# Altium schematic sheet MCU1710051108.SchDoc
size A2
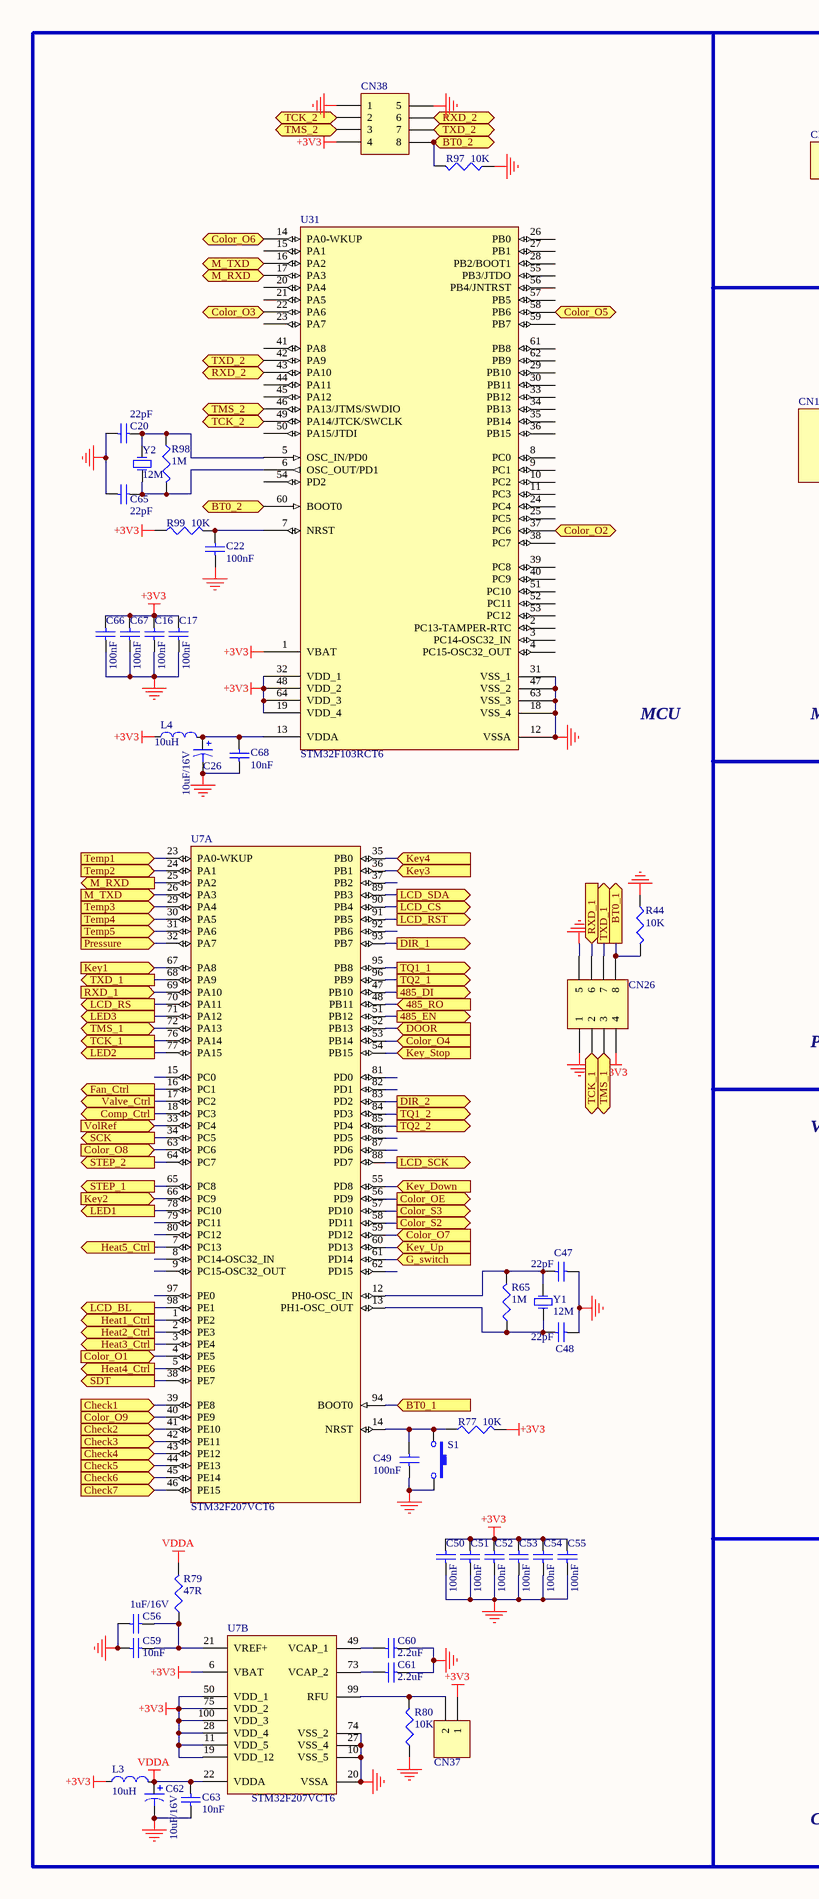
[diagram p0: MCU1710051108.SchDoc, left]
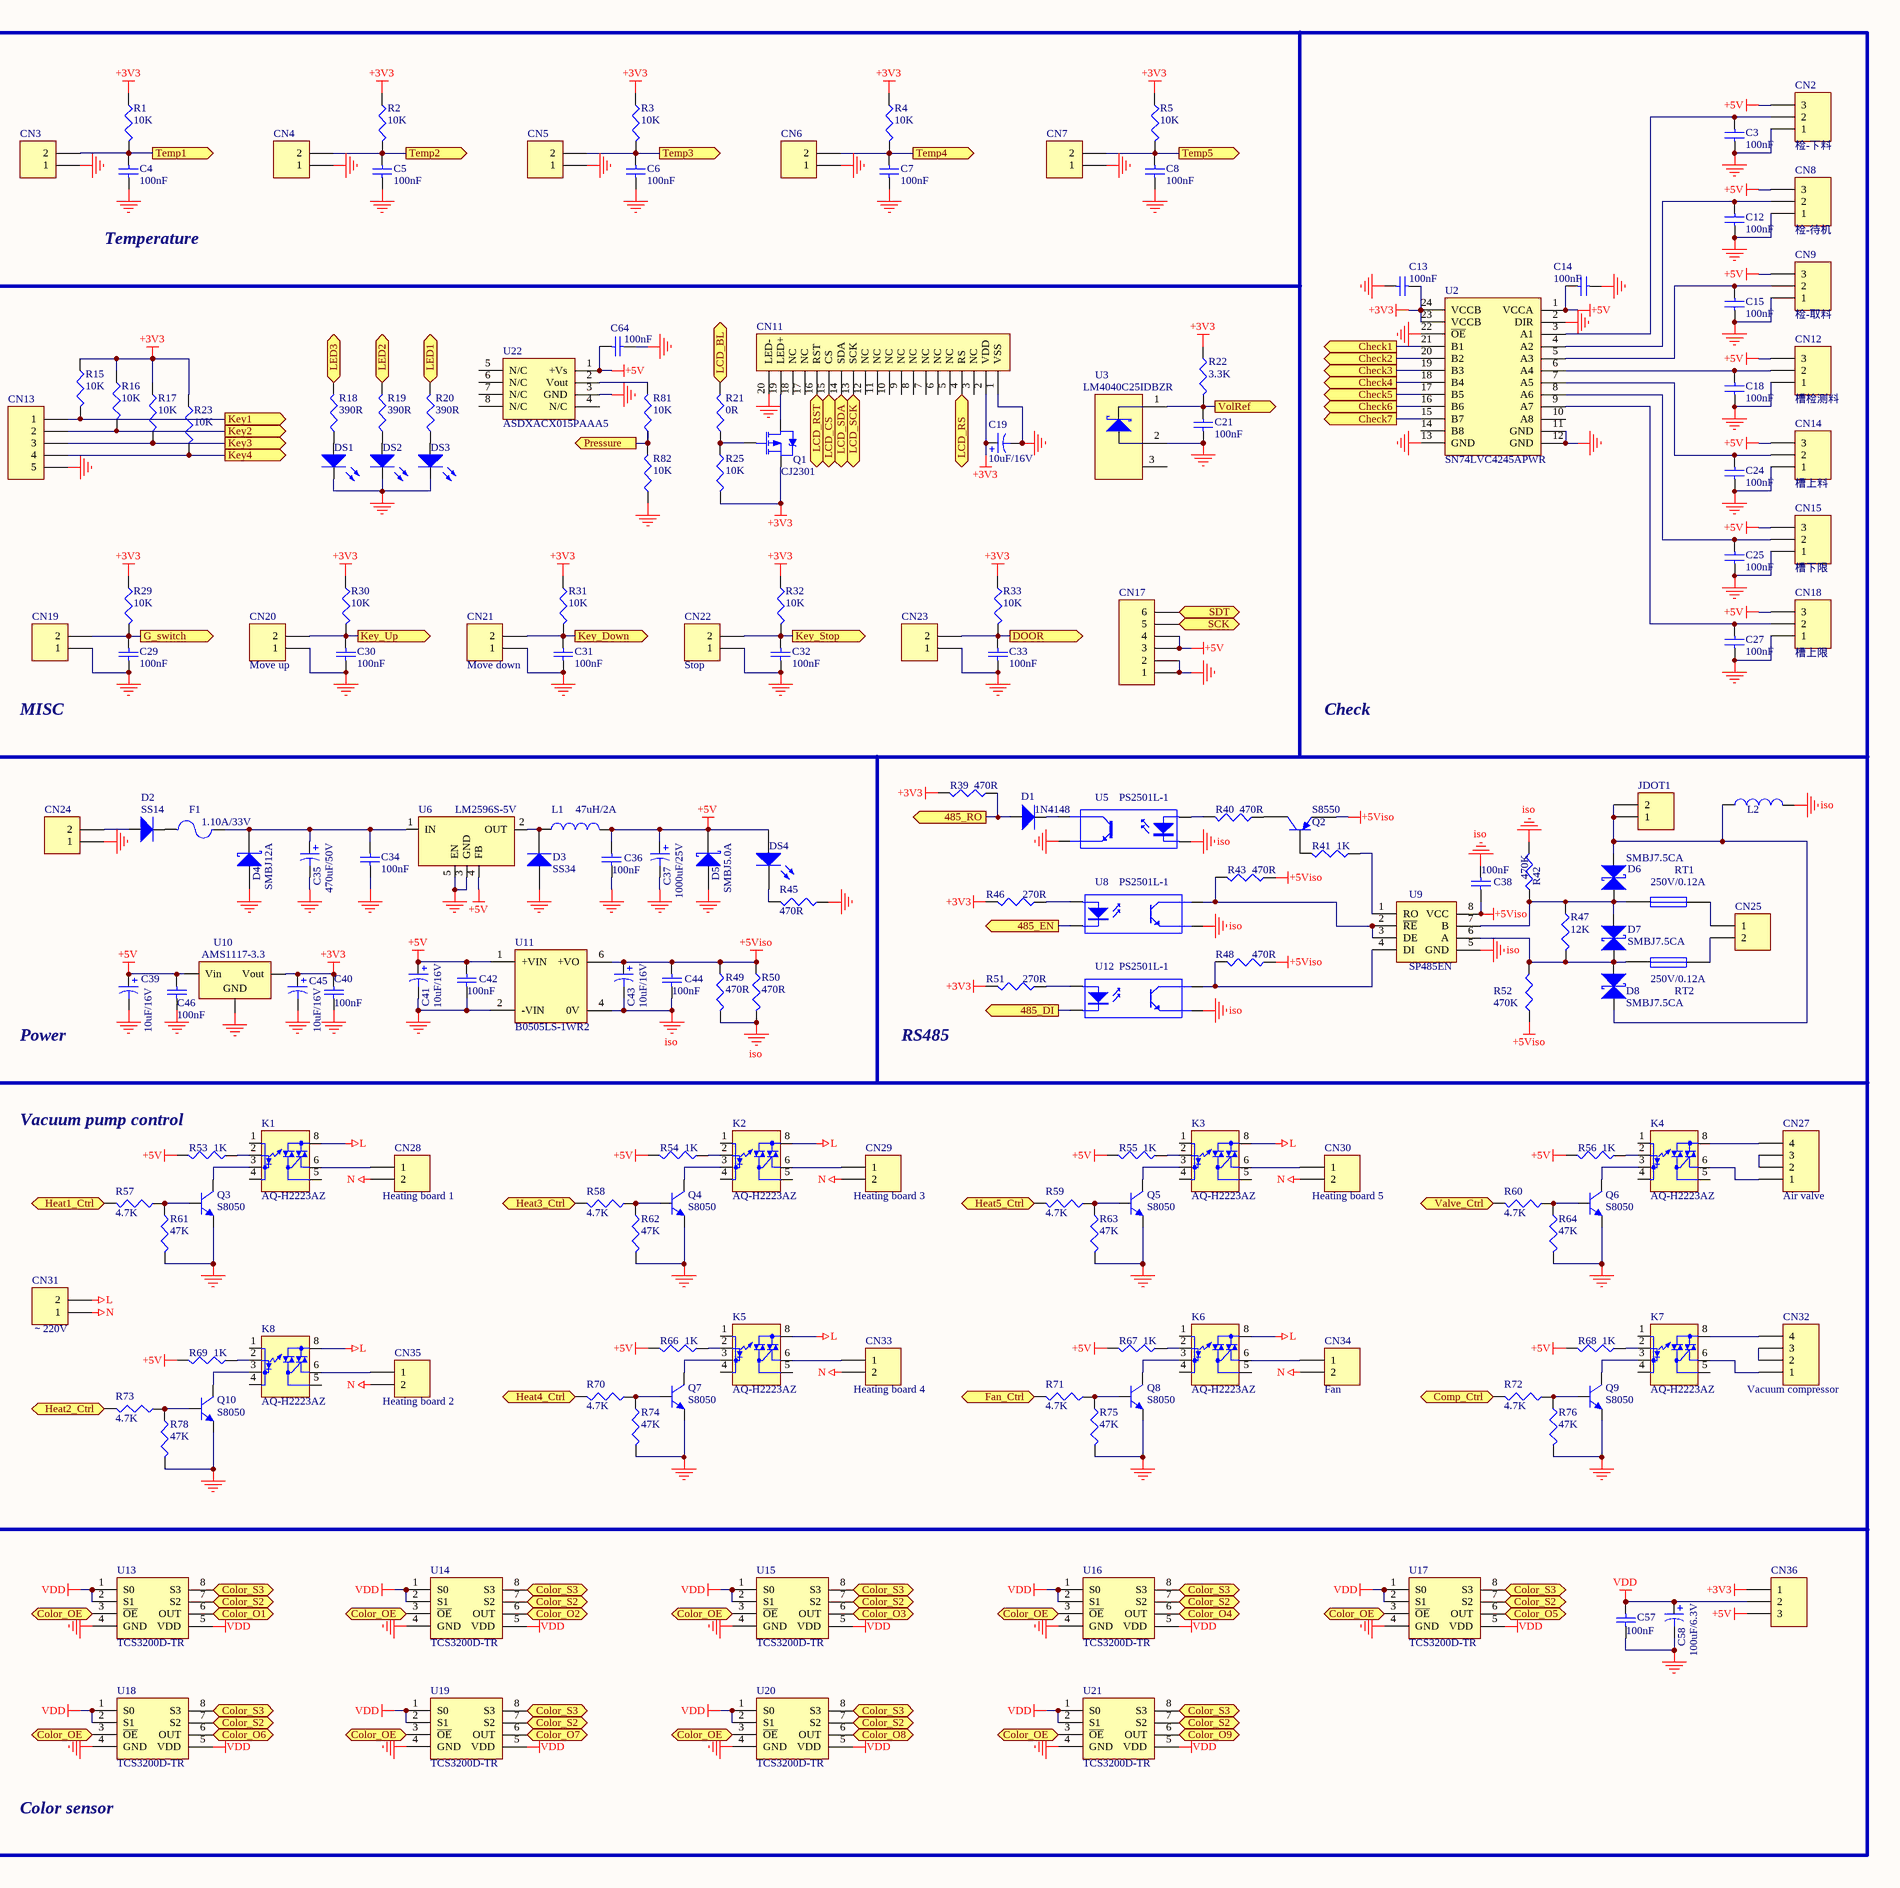
[diagram p1: MCU1710051108.SchDoc, right]

## Parts
C3  100nF  [C0603-3]
C4  100nF  [C0603-3]
C5  100nF  [C0603-3]
C6  100nF  [C0603-3]
C7  100nF  [C0603-3]
C8  100nF  [C0603-3]
C12  100nF  [C0603-3]
C13  100nF  [C0603-3]
C14  100nF  [C0603-3]
C15  100nF  [C0603-3]
C16  100nF  [C0603-3]
C17  100nF  [C0603-3]
C18  100nF  [C0603-3]
C19  10uF/16V  [CE1210]
C20  22pF  [C0603-3]
C21  100nF  [C0603-3]
C22  100nF  [C0603-3]
C24  100nF  [C0603-3]
C25  100nF  [C0603-3]
C26  10uF/16V  [CE1210]
C27  100nF  [C0603-3]
C29  100nF  [C0603-3]
C30  100nF  [C0603-3]
C31  100nF  [C0603-3]
C32  100nF  [C0603-3]
C33  100nF  [C0603-3]
C34  100nF  [C0603-3]
C35  470uF/50V  [CAP-D10/L20]
C36  100nF  [C0603-3]
C37  1000uF/25V  [CAP-D10/L20]
C38  100nF  [C0603-3]
C39  10uF/16V  [CE1210]
C40  100nF  [C0603-3]
C41  10uF/16V  [CE1210]
C42  100nF  [C0603-3]
C43  10uF/16V  [CE1210]
C44  100nF  [C0603-3]
C45  10uF/16V  [CE1210]
C46  100nF  [C0603-3]
C47  22pF  [C0603-3]
C48  22pF  [C0603-3]
C49  100nF  [C0603-3]
C50  100nF  [C0603-3]
C51  100nF  [C0603-3]
C52  100nF  [C0603-3]
C53  100nF  [C0603-3]
C54  100nF  [C0603-3]
C55  100nF  [C0603-3]
C56  1uF/16V  [C0805-2]
C57  100nF  [C0603-3]
C58  100uF/6.3V  [CASE-D_7343]
C59  10nF  [C0603-3]
C60  2.2uF  [C0603-3]
C61  2.2uF  [C0603-3]
C62  10uF/16V  [CE1210]
C63  10nF  [C0603-3]
C64  100nF  [C0603-3]
C65  22pF  [C0603-3]
C66  100nF  [C0603-3]
C67  100nF  [C0603-3]
C68  10nF  [C0603-3]
CN2  检-下料  [XHS3-2.5]
CN3  (no value)  [XHS2-2.5]
CN4  (no value)  [XHS2-2.5]
CN5  (no value)  [XHS2-2.5]
CN6  (no value)  [XHS2-2.5]
CN7  (no value)  [XHS2-2.5]
CN8  检-待机  [XHS3-2.5]
CN9  检-取料  [XHS3-2.5]
CN11  (no value)  [XH20-2.5]
CN12  槽检测料  [XHS3-2.5]
CN13  (no value)  [XHS5-2.5]
CN14  槽上料  [XHS3-2.5]
CN15  槽下限  [XHS3-2.5]
CN17  (no value)  [FFC/SM1.0-2H6]
CN18  槽上限  [XHS3-2.5]
CN19  (no value)  [XHS2-2.5]
CN20  Move up  [XHS2-2.5]
CN21  Move down  [XHS2-2.5]
CN22  Stop  [XHS2-2.5]
CN23  (no value)  [XHS2-2.5]
CN24  (no value)  [XHS2-2.5]
CN25  (no value)  [XHS2-2.5]
CN26  (no value)  [HDR2X4_CEN]
CN27  Air valve  [SIP4-8.25]
CN28  Heating board 1  [SIP2-8.25]
CN29  Heating board 3  [SIP2-8.25]
CN30  Heating board 5  [SIP2-8.25]
CN31  ～220V  [SIP2-8.25]
CN32  Vacuum compressor  [SIP4-8.25]
CN33  Heating board 4  [SIP2-8.25]
CN34  Fan  [SIP2-8.25]
CN35  Heating board 2  [SIP2-8.25]
CN36  (no value)  [SMD3-1.2]
CN37  (no value)  [SMD2-1.2]
CN38  (no value)  [HDR2X4_CEN]
D1  1N4148  [Mini-MELF]
D2  SS14  [SMA]
D3  SS34  [SMC]
D4  SMBJ12A  [SMB]
D5  SMBJ5.0A  [SMB]
D6  SMBJ7.5CA  [SMB-2]
D7  SMBJ7.5CA  [SMB-2]
D8  SMBJ7.5CA  [SMB-2]
DS1  (no value)  [LED-0805]
DS2  (no value)  [LED-0805]
DS3  (no value)  [LED-0805]
DS4  (no value)  [LED-0805]
F1  1.10A/33V  [1812]
JDOT1  (no value)  [PIN2-W4/L8.8]
K1  AQ-H2223AZ  [SOP8 -2.54]
K2  AQ-H2223AZ  [SOP8 -2.54]
K3  AQ-H2223AZ  [SOP8 -2.54]
K4  AQ-H2223AZ  [SOP8 -2.54]
K5  AQ-H2223AZ  [SOP8 -2.54]
K6  AQ-H2223AZ  [SOP8 -2.54]
K7  AQ-H2223AZ  [SOP8 -2.54]
K8  AQ-H2223AZ  [SOP8 -2.54]
L1  47uH/2A  [L-SMD-12]
L2  (no value)  [RH-10.0]
L3  10uH  [L0805]
L4  10uH  [L0805]
Q1  CJ2301  [SOT-23]
Q2  S8550  [SOT-23]
Q3  S8050  [SOT-23]
Q4  S8050  [SOT-23]
Q5  S8050  [SOT-23]
Q6  S8050  [SOT-23]
Q7  S8050  [SOT-23]
Q8  S8050  [SOT-23]
Q9  S8050  [SOT-23]
Q10  S8050  [SOT-23]
R1  10K  [R0603-3]
R2  10K  [R0603-3]
R3  10K  [R0603-3]
R4  10K  [R0603-3]
R5  10K  [R0603-3]
R15  10K  [R0603-3]
R16  10K  [R0603-3]
R17  10K  [R0603-3]
R18  390R  [R0603-3]
R19  390R  [R0603-3]
R20  390R  [R0603-3]
R21  0R  [R0603-3]
R22  3.3K  [R0603-3]
R23  10K  [R0603-3]
R25  10K  [R0603-3]
R29  10K  [R0603-3]
R30  10K  [R0603-3]
R31  10K  [R0603-3]
R32  10K  [R0603-3]
R33  10K  [R0603-3]
R39  470R  [R0603-3]
R40  470R  [R0603-3]
R41  1K  [R0603-3]
R42  470K  [R0603-3]
R43  470R  [R0603-3]
R44  10K  [R0603-3]
R45  470R  [R0603-3]
R46  270R  [R0603-3]
R47  12K  [R0603-3]
R48  470R  [R0603-3]
R49  470R  [R0603-3]
R50  470R  [R0603-3]
R51  270R  [R0603-3]
R52  470K  [R0603-3]
R53  1K  [R0603-3]
R54  1K  [R0603-3]
R55  1K  [R0603-3]
R56  1K  [R0603-3]
R57  4.7K  [R0603-3]
R58  4.7K  [R0603-3]
R59  4.7K  [R0603-3]
R60  4.7K  [R0603-3]
R61  47K  [R0603-3]
R62  47K  [R0603-3]
R63  47K  [R0603-3]
R64  47K  [R0603-3]
R65  1M  [R0603-3]
R66  1K  [R0603-3]
R67  1K  [R0603-3]
R68  1K  [R0603-3]
R69  1K  [R0603-3]
R70  4.7K  [R0603-3]
R71  4.7K  [R0603-3]
R72  4.7K  [R0603-3]
R73  4.7K  [R0603-3]
R74  47K  [R0603-3]
R75  47K  [R0603-3]
R76  47K  [R0603-3]
R77  10K  [R0603-3]
R78  47K  [R0603-3]
R79  47R  [R0805-3]
R80  10K  [R0603-3]
R81  10K  [R0603-3]
R82  10K  [R0603-3]
R97  10K  [R0603-3]
R98  1M  [R0603-3]
R99  10K  [R0603-3]
RT1  250V/0.12A  [FUSE-W2.8/L7.2]
RT2  250V/0.12A  [FUSE-W2.8/L7.2]
S1  (no value)  [SW_1102S]
U2  SN74LVC4245APWR  [TSSOP24-PW]
U3  LM4040C25IDBZR  [SOT-23]
U5  PS2501L-1  [SOP4-2.54]
U6  LM2596S-5V  [TO-263-5]
U7  STM32F207VCT6  [LQFP100_M]  (parts A,B of 2)
U8  PS2501L-1  [SOP4-2.54]
U9  SP485EN  [SOP8]
U10  AMS1117-3.3  [SOT-223]
U11  B0505LS-1WR2  [B-LS]
U12  PS2501L-1  [SOP4-2.54]
U13  TCS3200D-TR  [SOIC8]
U14  TCS3200D-TR  [SOIC8]
U15  TCS3200D-TR  [SOIC8]
U16  TCS3200D-TR  [SOIC8]
U17  TCS3200D-TR  [SOIC8]
U18  TCS3200D-TR  [SOIC8]
U19  TCS3200D-TR  [SOIC8]
U20  TCS3200D-TR  [SOIC8]
U21  TCS3200D-TR  [SOIC8]
U22  ASDXACX015PAAA5  [Legacy A2]
U31  STM32F103RCT6  [LQFP64_L]
Y1  12M  [OSC3225]
Y2  12M  [OSC3225]

## Ports
485_DI (out), 485_EN (out), 485_RO (in), 485_RO (out), BT0_1 (in), BT0_1 (out), BT0_2, BT0_2 (in), Check1 (in), Check1 (out), Check2 (in), Check2 (out), Check3 (in), Check3 (out), Check4 (in), Check4 (out), Check5 (in), Check5 (out), Check6 (in), Check6 (out), Check7 (in), Check7 (out), Color_O1 (in), Color_O1 (out), Color_O2 (in), Color_O2 (out), Color_O3 (in), Color_O3 (out), Color_O4 (in), Color_O4 (out), Color_O5 (in), Color_O5 (out), Color_O6 (in), Color_O6 (out), Color_O7 (in), Color_O7 (out), Color_O8 (in), Color_O8 (out), Color_O9 (in), Color_O9 (out), Color_OE (in), Color_OE (out), Color_S2 (in), Color_S2 (out), Color_S3 (in), Color_S3 (out), Comp_Ctrl (in), Comp_Ctrl (out), DIR_1 (out), DIR_2 (out), DOOR (in), DOOR (out), Fan_Ctrl (in), Fan_Ctrl (out), G_switch (in), G_switch (out), Heat1_Ctrl (in), Heat1_Ctrl (out), Heat2_Ctrl (in), Heat2_Ctrl (out), Heat3_Ctrl (in), Heat3_Ctrl (out), Heat4_Ctrl (in), Heat4_Ctrl (out), Heat5_Ctrl (in), Heat5_Ctrl (out), Key1 (in), Key1 (out), Key2 (in), Key2 (out), Key3 (in), Key3 (out), Key4 (in), Key4 (out), Key_Down (in), Key_Down (out), Key_Stop (in), Key_Stop (out), Key_Up (in), Key_Up (out), LCD_BL (in), LCD_BL (out), LCD_CS (in), LCD_CS (out), LCD_RS (in), LCD_RS (out), LCD_RST (in), LCD_RST (out), LCD_SCK (in), LCD_SCK (out), LCD_SDA (in), LCD_SDA (out), LED1 (in), LED1 (out), LED2 (in), LED2 (out), LED3 (in), LED3 (out), M_RXD (in), M_RXD (out), M_TXD (in), M_TXD (out), Pressure (in), Pressure (out), RXD_1 (in), RXD_2 (in), RXD_2 (out), SCK (in), SCK (out), SDT (in), SDT (out), STEP_1 (out), STEP_2 (out), TCK_1 (in), TCK_1 (out), TCK_2, TCK_2 (out), Temp1 (in), Temp1 (out), Temp2 (in), Temp2 (out), Temp3 (in), Temp3 (out), Temp4 (in), Temp4 (out), Temp5 (in), Temp5 (out), TMS_1, TMS_2, TQ1_1 (out), TQ1_2 (out), TQ2_1 (out), TQ2_2 (out), TXD_1 (out), TXD_2 (in), TXD_2 (out), Valve_Ctrl (in), Valve_Ctrl (out), VolRef (in), VolRef (out)

## Nets
+3V3: C13.1 C16.2 C17.2 C19.1 C40.2 C45.1 C50.2 C51.2 C52.2 C53.2 C54.2 C55.2 C66.2 C67.2 CN11.2(VDD) CN26.4 CN36.1 CN37.1 CN38.4 L3.1 L4.1 Q1.2(S) R1.2 R2.2 R3.2 R4.2 R5.2 R15.2 R16.2 R17.2 R22.1 R23.2 R25.2 R29.2 R30.2 R31.2 R32.2 R33.2 R39.2 R46.2 R51.2 R77.1 R99.1 U2.23(VCCB) U2.24(VCCB) U7.6(VBAT) U7.11(VDD_5) U7.19(VDD_12) U7.28(VDD_4) U7.50(VDD_1) U7.75(VDD_2) U7.100(VDD_3) U10.2(Vout) U31.1(VBAT) U31.19(VDD_4) U31.32(VDD_1) U31.48(VDD_2) U31.64(VDD_3)
+5V: C14.2 C36.2 C37.1 C39.1 C41.1 C42.1 C46.2 C64.1 CN2.3 CN8.3 CN9.3 CN12.3 CN14.3 CN15.3 CN17.3 CN17.4 CN18.3 CN36.3 D5.2(K) DS4.1(A) L1.2 R53.1 R54.1 R55.1 R56.1 R66.1 R67.1 R68.1 R69.1 U2.1(VCCA) U6.4(FB) U10.3(Vin) U11.1(+VIN) U22.1(+Vs)
+5Viso: C38.1 C43.1 C44.1 Q2.2(E) R43.1 R48.1 R49.1 R50.1 R52.2 U9.8(VCC) U11.6(+VO)
GND: C3.1 C4.2 C5.2 C6.2 C7.2 C8.2 C12.1 C13.2 C14.1 C15.1 C16.1 C17.1 C18.1 C19.2 C20.2 C21.2 C22.2 C24.1 C25.1 C26.2 C27.1 C29.1 C30.1 C31.1 C32.1 C33.1 C34.1 C35.2 C36.1 C37.2 C39.2 C40.1 C41.2 C42.2 C45.2 C46.1 C47.2 C48.2 C49.2 C50.1 C51.1 C52.1 C53.1 C54.1 C55.1 C56.2 C57.1 C58.2 C59.2 C60.1 C61.1 C62.2 C63.2 C64.2 C65.2 C66.1 C67.1 C68.2 CN2.1 CN3.1 CN4.1 CN5.1 CN6.1 CN7.1 CN8.1 CN9.1 CN11.1(VSS) CN11.20(LED-) CN12.1 CN13.5 CN14.1 CN15.1 CN17.1 CN17.2 CN18.1 CN19.1 CN20.1 CN21.1 CN22.1 CN23.1 CN24.1 CN26.1 CN26.5 CN38.1 CN38.5 D3.1(A) D4.1(A) D5.1(A) DS1.2(K) DS2.2(K) DS3.2(K) Q3.2(E) Q4.2(E) Q5.2(E) Q6.2(E) Q7.2(E) Q8.2(E) Q9.2(E) Q10.2(E) R44.1 R45.1 R61.2 R62.2 R63.2 R64.2 R74.2 R75.2 R76.2 R78.2 R80.1 R82.1 R97.1 S1.1 U2.2(DIR) U2.11(GND) U2.12(GND) U2.13(GND) U2.22(~{OE}) U3.2(K) U5.3(C) U6.3(GND) U6.5(EN) U7.10(VSS_5) U7.20(VSSA) U7.27(VSS_4) U7.74(VSS_2) U10.1(GND) U11.2(-VIN) U13.4(GND) U14.4(GND) U15.4(GND) U16.4(GND) U17.4(GND) U18.4(GND) U19.4(GND) U20.4(GND) U21.4(GND) U22.3(GND) U31.12(VSSA) U31.18(VSS_4) U31.31(VSS_1) U31.47(VSS_2) U31.63(VSS_3)
iso: C38.2 C43.2 C44.2 L2.2 R42.1 R49.2 R50.2 U5.2(K) U8.3(C) U9.5(GND) U11.4(0V) U12.3(C)
L: CN31.2 K1.8 K2.8 K3.8 K5.8 K6.8 K8.8
N: CN28.2 CN29.2 CN30.2 CN31.1 CN33.2 CN34.2 CN35.2
VDD: C57.2 C58.1 CN36.2 U13.1(S0) U13.2(S1) U13.5(VDD) U14.1(S0) U14.2(S1) U14.5(VDD) U15.1(S0) U15.2(S1) U15.5(VDD) U16.1(S0) U16.2(S1) U16.5(VDD) U17.1(S0) U17.2(S1) U17.5(VDD) U18.1(S0) U18.2(S1) U18.5(VDD) U19.1(S0) U19.2(S1) U19.5(VDD) U20.1(S0) U20.2(S1) U20.5(VDD) U21.1(S0) U21.2(S1) U21.5(VDD)
VDDA: C62.1 C63.1 L3.2 R79.2 U7.22(VDDA)
485_DI: U7.47(PB10) U12.2(K) ; port 485_DI
485_EN: U7.51(PB12) U8.2(K) ; port 485_EN
485_RO: D1.1(A) R39.1 U7.48(PB11) ; port 485_RO
BT0_1: CN26.8 R44.2 U7.94(BOOT0) ; port BT0_1
BT0_2: CN38.8 R97.2 U31.60(BOOT0) ; port BT0_2
Check1: U2.21(B1) U7.39(PE8) ; port Check1
Check2: U2.20(B2) U7.41(PE10) ; port Check2
Check3: U2.19(B3) U7.42(PE11) ; port Check3
Check4: U2.18(B4) U7.43(PE12) ; port Check4
Check5: U2.17(B5) U7.44(PE13) ; port Check5
Check6: U2.16(B6) U7.45(PE14) ; port Check6
Check7: U2.15(B7) U7.46(PE15) ; port Check7
Color_O1: U7.4(PE5) U13.6(OUT) ; port Color_O1
Color_O2: U14.6(OUT) U31.37(PC6) ; port Color_O2
Color_O3: U15.6(OUT) U31.22(PA6) ; port Color_O3
Color_O4: U7.53(PB14) U16.6(OUT) ; port Color_O4
Color_O5: U17.6(OUT) U31.58(PB6) ; port Color_O5
Color_O6: U18.6(OUT) U31.14(PA0-WKUP) ; port Color_O6
Color_O7: U7.59(PD12) U19.6(OUT) ; port Color_O7
Color_O8: U7.63(PC6) U20.6(OUT) ; port Color_O8
Color_O9: U7.40(PE9) U21.6(OUT) ; port Color_O9
Color_OE: U7.56(PD9) U13.3(~{OE}) U14.3(~{OE}) U15.3(~{OE}) U16.3(~{OE}) U17.3(~{OE}) U18.3(~{OE}) U19.3(~{OE}) U20.3(~{OE}) U21.3(~{OE}) ; port Color_OE
Color_S2: U7.58(PD11) U13.7(S2) U14.7(S2) U15.7(S2) U16.7(S2) U17.7(S2) U18.7(S2) U19.7(S2) U20.7(S2) U21.7(S2) ; port Color_S2
Color_S3: U7.57(PD10) U13.8(S3) U14.8(S3) U15.8(S3) U16.8(S3) U17.8(S3) U18.8(S3) U19.8(S3) U20.8(S3) U21.8(S3) ; port Color_S3
Comp_Ctrl: R72.1 U7.18(PC3) ; port Comp_Ctrl
DIR_1: U7.93(PB7) ; port DIR_1
DIR_2: U7.83(PD2) ; port DIR_2
DOOR: C33.2 CN23.2 R33.1 U7.52(PB13) ; port DOOR
Fan_Ctrl: R71.1 U7.16(PC1) ; port Fan_Ctrl
G_switch: C29.2 CN19.2 R29.1 U7.61(PD14) ; port G_switch
Heat1_Ctrl: R57.1 U7.1(PE2) ; port Heat1_Ctrl
Heat2_Ctrl: R73.1 U7.2(PE3) ; port Heat2_Ctrl
Heat3_Ctrl: R58.1 U7.3(PE4) ; port Heat3_Ctrl
Heat4_Ctrl: R70.1 U7.5(PE6) ; port Heat4_Ctrl
Heat5_Ctrl: R59.1 U7.7(PC13) ; port Heat5_Ctrl
Key1: CN13.1 R15.1 U7.67(PA8) ; port Key1
Key2: CN13.2 R16.1 U7.66(PC9) ; port Key2
Key3: CN13.3 R17.1 U7.36(PB1) ; port Key3
Key4: CN13.4 R23.1 U7.35(PB0) ; port Key4
Key_Down: C31.2 CN21.2 R31.1 U7.55(PD8) ; port Key_Down
Key_Stop: C32.2 CN22.2 R32.1 U7.54(PB15) ; port Key_Stop
Key_Up: C30.2 CN20.2 R30.1 U7.60(PD13) ; port Key_Up
LCD_BL: R21.2 U7.98(PE1) ; port LCD_BL
LCD_CS: CN11.15(CS) U7.90(PB4) ; port LCD_CS
LCD_RS: CN11.4(RS) U7.70(PA11) ; port LCD_RS
LCD_RST: CN11.16(RST) U7.91(PB5) ; port LCD_RST
LCD_SCK: CN11.13(SCK) U7.88(PD7) ; port LCD_SCK
LCD_SDA: CN11.14(SDA) U7.89(PB3) ; port LCD_SDA
LED1: R20.2 U7.78(PC10) ; port LED1
LED2: R19.2 U7.77(PA15) ; port LED2
LED3: R18.2 U7.71(PA12) ; port LED3
M_RXD: U7.25(PA2) U31.17(PA3) ; port M_RXD
M_TXD: U7.26(PA3) U31.16(PA2) ; port M_TXD
Pressure: R81.1 R82.2 U7.32(PA7) ; port Pressure
RXD_1: CN26.6 U7.69(PA10) ; port RXD_1
RXD_2: CN38.6 U31.43(PA10) ; port RXD_2
SCK: CN17.5 U7.34(PC5) ; port SCK
SDT: CN17.6 U7.38(PE7) ; port SDT
STEP_1: U7.65(PC8) ; port STEP_1
STEP_2: U7.64(PC7) ; port STEP_2
TCK_1: CN26.2 U7.76(PA14) ; port TCK_1
TCK_2: CN38.2 U31.49(PA14/JTCK/SWCLK) ; port TCK_2
Temp1: C4.1 CN3.2 R1.1 U7.23(PA0-WKUP) ; port Temp1
Temp2: C5.1 CN4.2 R2.1 U7.24(PA1) ; port Temp2
Temp3: C6.1 CN5.2 R3.1 U7.29(PA4) ; port Temp3
Temp4: C7.1 CN6.2 R4.1 U7.30(PA5) ; port Temp4
Temp5: C8.1 CN7.2 R5.1 U7.31(PA6) ; port Temp5
TMS_1: CN26.3 U7.72(PA13) ; port TMS_1
TMS_2: CN38.3 U31.46(PA13/JTMS/SWDIO) ; port TMS_2
TQ1_1: U7.95(PB8) ; port TQ1_1
TQ1_2: U7.84(PD3) ; port TQ1_2
TQ2_1: U7.96(PB9) ; port TQ2_1
TQ2_2: U7.85(PD4) ; port TQ2_2
TXD_1: CN26.7 U7.68(PA9) ; port TXD_1
TXD_2: CN38.7 U31.42(PA9) ; port TXD_2
Valve_Ctrl: R60.1 U7.17(PC2) ; port Valve_Ctrl
VolRef: C21.1 R22.2 U3.1(A) U7.33(PC4) ; port VolRef
NetC3_2: C3.2 CN2.2 U2.3(A1)
NetC12_2: C12.2 CN8.2 U2.4(A2)
NetC15_2: C15.2 CN9.2 U2.5(A3)
NetC18_2: C18.2 CN12.2 U2.6(A4)
NetC20_1: C20.1 R98.1 U31.5(OSC_IN/PD0) Y2.1(OSC1)
NetC22_1: C22.1 R99.2 U31.7(NRST)
NetC24_2: C24.2 CN14.2 U2.7(A5)
NetC25_2: C25.2 CN15.2 U2.8(A6)
NetC26_1: C26.1 C68.1 L4.2 U31.13(VDDA)
NetC27_2: C27.2 CN18.2 U2.9(A7)
NetC34_2: C34.2 C35.1 D4.2(K) F1.2 U6.1(IN)
NetC47_1: C47.1 R65.2 U7.12(PH0-OSC_IN) Y1.3(OSC2)
NetC48_1: C48.1 R65.1 U7.13(PH1-OSC_OUT) Y1.1(OSC1)
NetC49_1: C49.1 R77.2 S1.2 U7.14(NRST)
NetC56_1: C56.1 C59.1 R79.1 U7.21(VREF+)
NetC60_2: C60.2 U7.49(VCAP_1)
NetC61_2: C61.2 U7.73(VCAP_2)
NetC65_1: C65.1 R98.2 U31.6(OSC_OUT/PD1) Y2.3(OSC2)
NetCN11_19: CN11.19(LED+) Q1.3(D)
NetCN24_2: CN24.2 D2.1(A)
NetCN25_1: CN25.1 RT1.2
NetCN25_2: CN25.2 RT2.2
NetCN27_1: CN27.1 K4.6
NetCN27_2: CN27.2 CN27.3
NetCN27_4: CN27.4 K4.8
NetCN28_1: CN28.1 K1.6
NetCN29_1: CN29.1 K2.6
NetCN30_1: CN30.1 K3.6
NetCN32_1: CN32.1 K7.6
NetCN32_2: CN32.2 CN32.3
NetCN32_4: CN32.4 K7.8
NetCN33_1: CN33.1 K5.6
NetCN34_1: CN34.1 K6.6
NetCN35_1: CN35.1 K8.6
NetCN37_2: CN37.2 R80.2 U7.99(RFU)
NetD1_2: D1.2(K) U5.4(D)
NetD2_2: D2.2(K) F1.1
NetD3_2: D3.2(K) L1.1 U6.2(OUT)
NetD6_1: D6.1(A) D7.2(K) R42.2 R47.1 RT1.1 U9.7(B)
NetD6_2: D6.2(K) D8.2(K) JDOT1.1 JDOT1.2 L2.1
NetD7_1: D7.1(A) D8.1(A) R47.2 R52.1 RT2.1 U9.6(A)
NetDS1_1: DS1.1(A) R18.1
NetDS2_1: DS2.1(A) R19.1
NetDS3_1: DS3.1(A) R20.1
NetDS4_2: DS4.2(K) R45.2
NetK1_2: K1.2(+) R53.2
NetK1_3: K1.3(--) Q3.3(C)
NetK2_2: K2.2(+) R54.2
NetK2_3: K2.3(--) Q4.3(C)
NetK3_2: K3.2(+) R55.2
NetK3_3: K3.3(--) Q5.3(C)
NetK4_2: K4.2(+) R56.2
NetK4_3: K4.3(--) Q6.3(C)
NetK5_2: K5.2(+) R66.2
NetK5_3: K5.3(--) Q7.3(C)
NetK6_2: K6.2(+) R67.2
NetK6_3: K6.3(--) Q8.3(C)
NetK7_2: K7.2(+) R68.2
NetK7_3: K7.3(--) Q9.3(C)
NetK8_2: K8.2(+) R69.2
NetK8_3: K8.3(--) Q10.3(C)
NetQ1_1: Q1.1(G) R21.1 R25.1
NetQ2_1: Q2.1(B) R41.2
NetQ2_3: Q2.3(C) R40.1
NetQ3_1: Q3.1(B) R57.2 R61.1
NetQ4_1: Q4.1(B) R58.2 R62.1
NetQ5_1: Q5.1(B) R59.2 R63.1
NetQ6_1: Q6.1(B) R60.2 R64.1
NetQ7_1: Q7.1(B) R70.2 R74.1
NetQ8_1: Q8.1(B) R71.2 R75.1
NetQ9_1: Q9.1(B) R72.2 R76.1
NetQ10_1: Q10.1(B) R73.2 R78.1
NetR40_2: R40.2 U5.1(A)
NetR41_1: R41.1 U9.1(RO)
NetR43_2: R43.2 U8.4(D) U9.2(~{RE}) U9.3(DE)
NetR46_1: R46.1 U8.1(A)
NetR48_2: R48.2 U9.4(DI) U12.4(D)
NetR51_1: R51.1 U12.1(A)
NetR81_2: R81.2 U22.2(Vout)

Not connected (* = marked no-connect by the designer): CN11 3(NC) 5(NC) 6(NC) 7(NC) 8(NC) 9(NC) 10(NC) 11(NC) 12(NC) 17(NC) 18(NC); K1 1 4 5; K2 1 4 5; K3 1 4 5; K4 1 4 5; K5 1 4 5; K6 1 4 5; K7 1 4 5; K8 1 4 5; U2 10(A8) 14(B8); U3 3; U7 8(PC14-OSC32_IN) 9(PC15-OSC32_OUT) 15(PC0) 37(PB2) 62(PD15) 79(PC11) 80(PC12) 81(PD0) 82(PD1) 86(PD5) 87(PD6) 92(PB6) 97(PE0); U22 4(N/C) 5(N/C) 6(N/C) 7(N/C) 8(N/C); U31 2(PC13-TAMPER-RTC) 3(PC14-OSC32_IN) 4(PC15-OSC32_OUT) 8(PC0) 9(PC1) 10(PC2) 11(PC3) 15(PA1) 20(PA4) 21(PA5) 23(PA7) 24(PC4) 25(PC5) 26(PB0) 27(PB1) 28(PB2/BOOT1) 29(PB10) 30(PB11) 33(PB12) 34(PB13) 35(PB14) 36(PB15) 38(PC7) 39(PC8) 40(PC9) 41(PA8) 44(PA11) 45(PA12) 50(PA15/JTDI) 51(PC10) 52(PC11) 53(PC12) 54(PD2) 55(PB3/JTDO) 56(PB4/JNTRST) 57(PB5) 59(PB7) 61(PB8) 62(PB9)

## Notes on the sheet
- Temperature
- MCU
- MISC
- Check
- Power
- RS485
- (near R53) Vacuum pump control
- Color sensor

## Library data of the parts
C3-C8 C12-C18 C20-C22 C24 C25 C27 C29-C34 C36 C38 C40 C42 C44 C46-C57 C59-C61 C63-C68 = Cap: Capacitor; Value: 100pF; Published: 8-Jun-2000; LatestRevisionDate: 17-Jul-2002; LatestRevisionNote: Re-released for DXP Platform.; PackageReference: RAD-0.3; Publisher: Altium Limited
  C4-C8 C13 C14 C16 C17 C20-C22 C38 C40 C42 C44 C46-C56 C59-C61 C63-C68: PackageDescription: Radial Cap, Thru-Hole; 2 Leads; 0.3 in Pin Spacing
C19 C26 C35 C37 C39 C41 C43 C45 C58 C62 = Cap Pol1: Polarized Capacitor (Radial); Value: 100pF; Published: 8-Jun-2000; LatestRevisionDate: 17-Jul-2002; LatestRevisionNote: Re-released for DXP Platform.; PackageReference: RB7.6-15; Publisher: Altium Limited; PackageDescription: Polarized Capacitor (Radial); 2 Leads
CN2 CN8 CN9 CN12 CN14 CN15 CN18 CN36 = Header 3: Header, 3-Pin; LatestRevisionDate: 17-Jul-2002; LatestRevisionNote: Re-released for DXP Platform.; Publisher: Altium Limited
CN3-CN7 CN19-CN25 CN28-CN31 CN33-CN35 CN37 JDOT1 = Header 2: Header, 2-Pin; LatestRevisionDate: 17-Jul-2002; LatestRevisionNote: Re-released for DXP Platform.; Publisher: Altium Limited
CN11 = LCD: 12864
CN13 = Header 5: Header, 5-Pin; LatestRevisionDate: 17-Jul-2002; LatestRevisionNote: Re-released for DXP Platform.; Publisher: Altium Limited
CN17 = Header 6: Header, 6-Pin; LatestRevisionDate: 17-Jul-2002; LatestRevisionNote: Re-released for DXP Platform.; Publisher: Altium Limited
CN26 CN38 = Header 4X2A: Header, 4-Pin, Dual row; LatestRevisionDate: 17-Jul-2002; LatestRevisionNote: Re-released for DXP Platform.; Publisher: Altium Limited
CN27 CN32 = Header 4: Header, 4-Pin; LatestRevisionDate: 17-Jul-2002; LatestRevisionNote: Re-released for DXP Platform.; Publisher: Altium Limited
D1 D2 = Diode
D3 = Diode: Default Diode; Published: 8-Jun-2000; LatestRevisionDate: 17-Jul-2002; LatestRevisionNote: Re-released for DXP Platform.; PackageVersion: Sep-1996; PackageReference: SMC; Publisher: Altium Limited; PackageDescription: DO-214-AB/SMC; 2 C-Bend Leads; Body 7.9 x 5.9 mm, inc. leads (LxW); Code_JEDEC: DO-214-AB
D4 D5 = D Schottky: Schottky Diode; Published: 8-Jun-2000; LatestRevisionDate: 17-Jul-2002; LatestRevisionNote: Re-released for DXP Platform.; PackageReference: SMB; Publisher: Altium Limited; PackageDescription: DO-214-AA/SMB; 2 C-Bend Leads; Body 5.3 x 3.6 mm, inc. leads (LxW); Code_JEDEC: DO-214-AA
D6-D8 = TVS
DS1-DS4 = LED0: Typical INFRARED GaAs LED; Published: 8-Jun-2000; LatestRevisionDate: 08-Jul-2005; LatestRevisionNote: Mech Layer 1 removed.; PackageReference: LED-0; Publisher: Altium Limited; PackageDescription: LED; 2 Leads
F1 = Fuse 2
K1-K8 = AQ-H2223: Solid state relay
L1 L2 = Inductor: Code_IEC: 1005; Value: 10mH; Published: 8-Jun-2000; LatestRevisionDate: 29-May-2009; LatestRevisionNote: IPC-7351 Footprint Added.; PackageReference: 0402-A; Publisher: Altium Limited; PackageDescription: Chip Inductor; Code_JEITA: 0402
L3 L4 = L
Q1 = PMOS-1: P-Channel MOSFET; Note: Pin 4 not drawn and electrically connected to Pin 2.; Published: 8-Jun-2000; LatestRevisionDate: 17-Jul-2002; LatestRevisionNote: Re-released for DXP Platform.; DatasheetVersion: PD-9.390D; PackageVersion: Feb-1997; PackageReference: TO-220AB; Publisher: Altium Limited; PackageDescription: TO, Thru-Hole, Vertical, Heatsink Mounted; 3 In-Line Leads; Pitch 2.54 mm; ComponentLink1Description: Manufacturer Link; ComponentLink1URL: http://www.irf.com/
Q2 = PNP
Q3-Q10 = NPN
R1-R5 R15-R23 R25 R29-R33 R39 R40 R42-R52 R57-R65 R70-R82 R97-R99 = Res3: Resistor; Value: 1K; Published: 8-Jun-2000; LatestRevisionDate: 29-May-2009; LatestRevisionNote: IPC-7351 Footprint Added.; PackageReference: J1-0603; Publisher: Altium Limited; PackageDescription: Chip Resistor
R41 R53-R56 R66-R69 = Res3: Resistor; Published: 8-Jun-2000; LatestRevisionDate: 29-May-2009; LatestRevisionNote: IPC-7351 Footprint Added.; PackageReference: J1-0603; Publisher: Altium Limited; PackageDescription: Chip Resistor; Value: 1K
RT1 RT2 = Fuse 1: Fuse; Published: 8-Jun-2000; LatestRevisionDate: 17-Jul-2002; LatestRevisionNote: Re-released for DXP Platform.; PackageReference: PIN-W2/E2.8; Publisher: Altium Limited; PackageDescription: Thru-Hole; 2 Leads
S1 = SW-PB: Switch
U2 = SN74LVC4245A: OCTAL BUS TRANSCEIVER AND 3.3-V TO 5-V SHIFTER
U3 = LM4040xxx: Precision Micropower Shunt Voltage Reference
U5 U8 U12 = PC187
U7 = STM32F207VCT6: STM32 ARM-based 32-bit MCU Connectivity Line & Ethernet with 256 kB Flash, 128 kB Internal RAM, -40 to +85°C Temperature, 100-Pin LQFP, Tray; DatasheetVersion: rev6.0, Apr-2011; PackageVersion: rev13, Apr-2011; PackageReference: LQFP100; PackageDescription: 100-Pin Low-Profile Quad Flat Pack, 14 x 14 mm Body, 0.5 mm Pitch (LQFP100); ComponentLink1Description: Manufacturer URL; ComponentLink1URL: http://www.st.com/; ComponentLink2Description: STM32F205/207 Datasheet; ComponentLink2URL: http://www.st.com/internet/com/TECHNICAL_RESOURCES/TECHNICAL_LITERATURE/DATASHEET/CD00237391.pdf; ComponentLink3Description: STM32 Family Web Page; ComponentLink3URL: www.st.com/stm32
U9 = MAX485
U10 = AMS1117
U11 = A_S-1WR2 & B_LS-1WR2: A_S-1WR2 & B_LS-1WR2 Series 1W, FIXED INPUT, ISOLATED & UNREGULATED
U13-U21 = TCS3200: Programmable Color Light-to-Frequency Converter
U22 = ASDXACX015PAAA5: ASDX 系列，15 psi 绝压，A2 型封装，19A-E66 counts（计数）输出; 厂家: Honeywell
U31 = STM32F103RCT6: STM32 ARM-based 32-bit MCU with 256 Kbytes Flash, 64-pin LQFP, Industrial Temperature; Published: *; DatasheetVersion: *; PackageVersion: *; PackageReference: *; Publisher: *; PackageDescription: *; ComponentLink1Description: *; ComponentLink1URL: *; ComponentLink2Description: *; ComponentLink2URL: *
Y1 Y2 = XTAL2: Crystal Oscillator; Published: 8-Jun-2000; LatestRevisionDate: 17-Jul-2002; LatestRevisionNote: Re-released for DXP Platform.; PackageReference: R38; Publisher: Altium Limited; PackageDescription: Crystal, Thru-Hole; 2 Leads; Body 3.1 x 8.2 mm (Dia.xH)